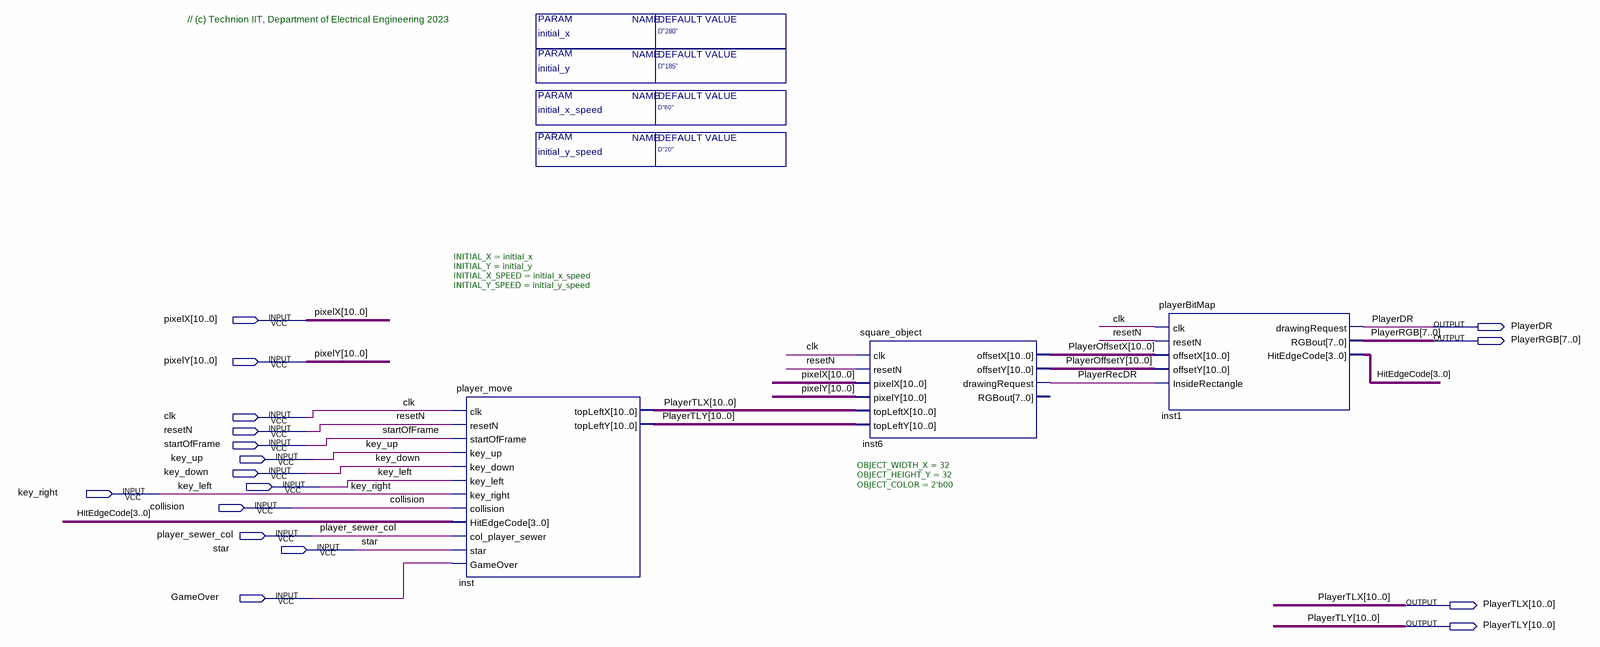
[diagram p0: schematic sheet]
// Quartus schematic Player_Block_T.bdf as structural Verilog: 3 symbols, 17 pins
module Player_Block_T #(parameter initial_x = "D\"280\"", parameter initial_y = "D\"185\"", parameter initial_x_speed = "D\"60\"", parameter initial_y_speed = "D\"20\"") (
  input  [10:0] pixelX,
  input  [10:0] pixelY,
  input  clk,
  input  resetN,
  input  startOfFrame,
  input  key_up,
  input  key_down,
  input  key_left,
  input  key_right,
  input  collision,
  input  player_sewer_col,
  input  star,
  input  GameOver,
  output PlayerDR,
  output [7:0] PlayerRGB,
  output [10:0] PlayerTLX,
  output [10:0] PlayerTLY
);

  wire PlayerRecDR;
  wire [3:0] HitEdgeCode;
  wire [10:0] PlayerOffsetX, PlayerOffsetY;

  player_move #(.INITIAL_X(initial_x), .INITIAL_Y(initial_y), .INITIAL_X_SPEED(initial_x_speed), .INITIAL_Y_SPEED(initial_y_speed)) inst (
    .clk(clk), .resetN(resetN), .startOfFrame(startOfFrame), .key_up(key_up), .key_down(key_down),
    .key_left(key_left), .key_right(key_right), .collision(collision), .HitEdgeCode(HitEdgeCode),
    .col_player_sewer(player_sewer_col), .star(star), .GameOver(GameOver), .topLeftX(PlayerTLX),
    .topLeftY(PlayerTLY));
  square_object #(.OBJECT_WIDTH_X(32), .OBJECT_HEIGHT_Y(32), .OBJECT_COLOR(2'b00)) inst6 (
    .clk(clk), .resetN(resetN), .pixelX(pixelX), .pixelY(pixelY), .topLeftX(PlayerTLX), .topLeftY(PlayerTLY),
    .offsetX(PlayerOffsetX), .offsetY(PlayerOffsetY), .drawingRequest(PlayerRecDR));  // open: RGBout
  playerBitMap inst1 (
    .clk(clk), .resetN(resetN), .offsetX(PlayerOffsetX), .offsetY(PlayerOffsetY),
    .InsideRectangle(PlayerRecDR), .drawingRequest(PlayerDR), .RGBout(PlayerRGB), .HitEdgeCode(HitEdgeCode));

  // Notes on the sheet:
  //   // (c) Technion IIT, Department of Electrical Engineering 2023
endmodule
